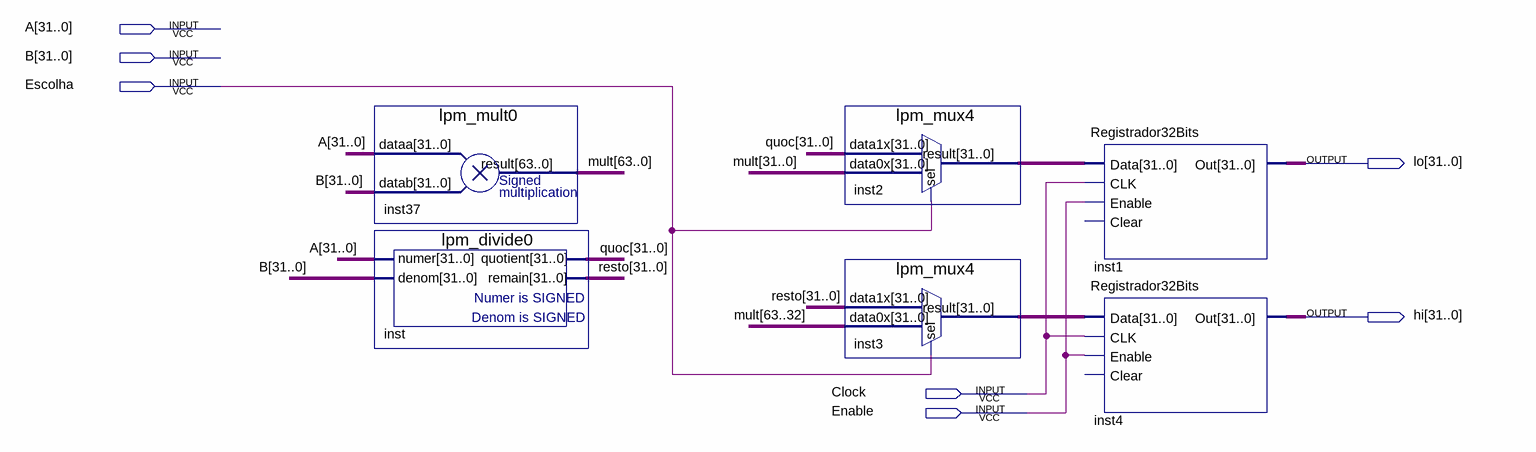
[diagram p0: schematic sheet]
// Quartus schematic Mult_Div.bdf as structural Verilog: 6 symbols, 7 pins
module Mult_Div (
  input  [31:0] A,
  input  [31:0] B,
  input  Escolha,
  input  Clock,
  input  Enable,
  output [31:0] lo,
  output [31:0] hi
);

  wire [31:0] inst2_result, inst3_result, quoc, resto;
  wire [63:0] mult;

  lpm_mult0 inst37 (.dataa(A), .datab(B), .result(mult));
  lpm_divide0 inst (.numer(A), .denom(B), .quotient(quoc), .remain(resto));
  lpm_mux4 inst2 (.data1x(quoc), .data0x(mult[31:0]), .sel(Escolha), .result(inst2_result));
  lpm_mux4 inst3 (.data1x(resto), .data0x(mult[63:32]), .sel(Escolha), .result(inst3_result));
  Registrador32Bits inst1 (.Data(inst2_result), .CLK(Clock), .Enable(Enable), .Out(lo));  // open: Clear
  Registrador32Bits inst4 (.Data(inst3_result), .CLK(Clock), .Enable(Enable), .Out(hi));  // open: Clear
endmodule
